# EAGLE schematic VentaConnected_Entwurf (EAGLE 8.2.1)
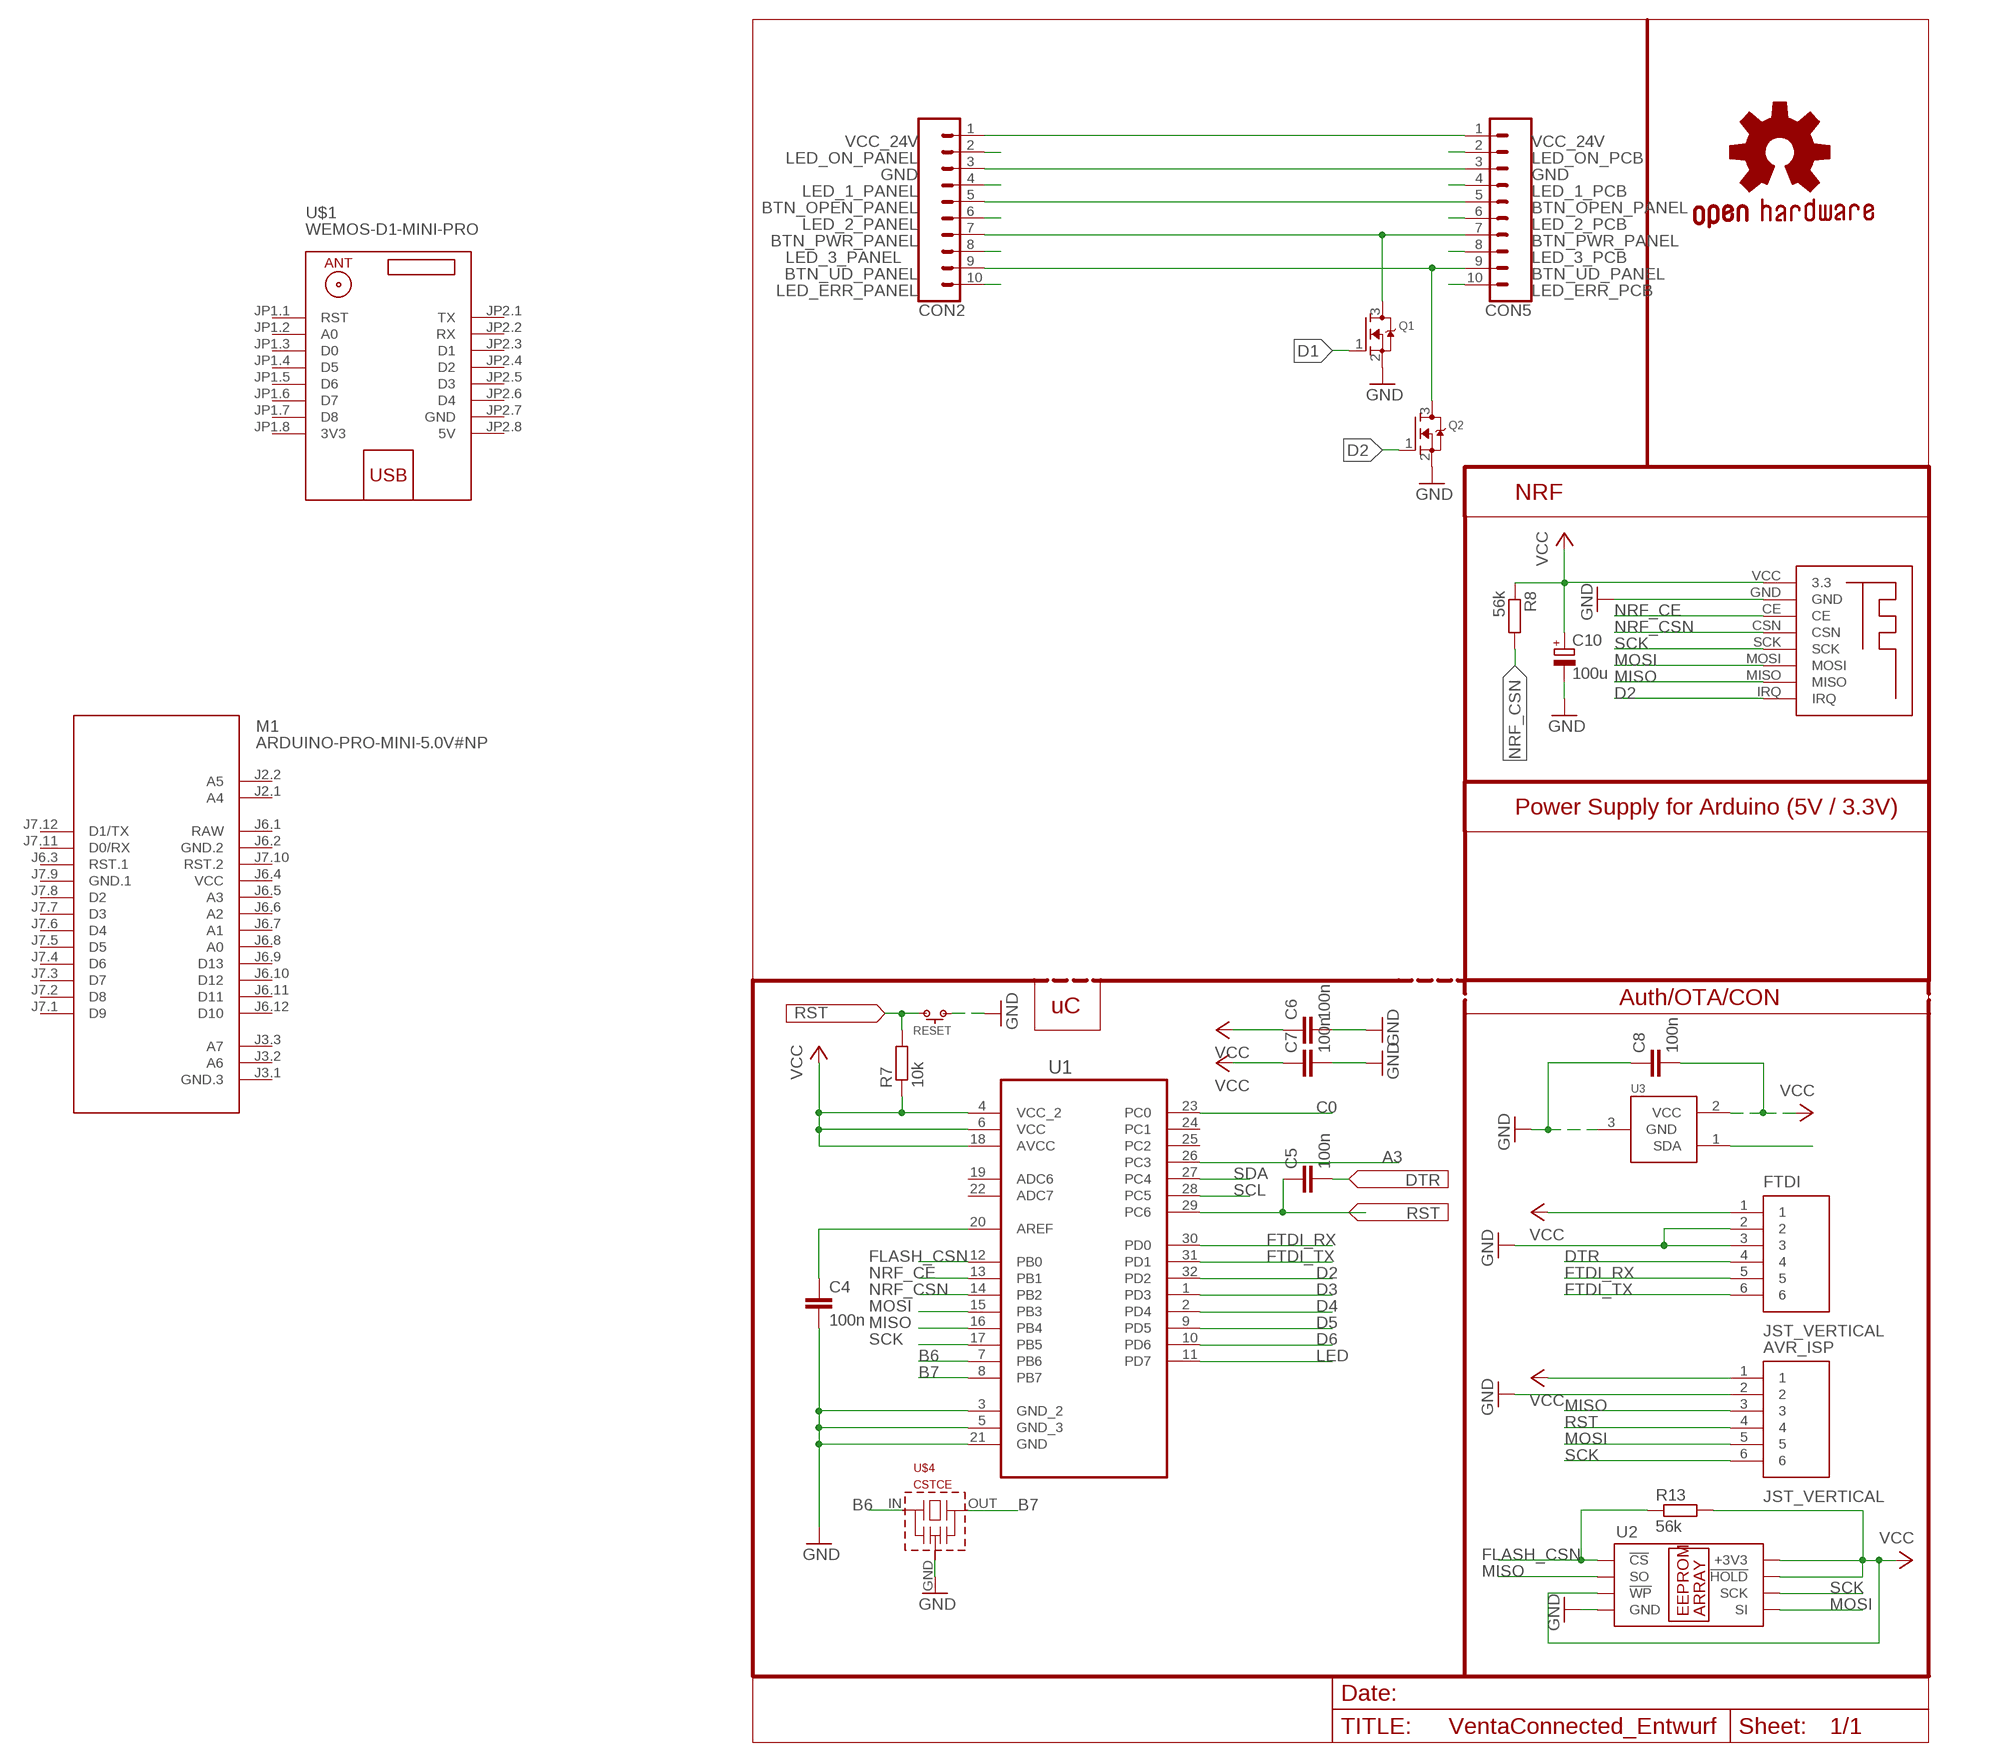
[diagram p0: schematic, sheet 1]

## Parts
AVR_ISP  JST_VERTICAL  [JST-6-SMD-VERT-1.0MM]
C4  100n  C-EUC0805  [C0805]
C5  100n  C-EUC0805  [C0805]
C6  100n  C-EUC0805  [C0805]
C7  100n  C-EUC0805  [C0805]
C8  100n  C-EUC0805  [C0805]
C10  100u  CPOL-EUUD-5X5,8  [UD-5X5,8_NICHICON]
CON2  CONN_10LOCK_LONGPADS  [1X10_LOCK_LONGPADS]
CON5  CONN_10LOCK_LONGPADS  [1X10_LOCK_LONGPADS]
FTDI  JST_VERTICAL  [JST-6-SMD-VERT-1.0MM]
GOLD_ORB_SM1  OSHWLOGO_GOLD_ORB_SM  [OSHW2]
M1  ARDUINO-PRO-MINI-5.0V#NP  [ARDUINO-PRO-MINI#NP]
Q1  MOSFET-NREFLOW  [SOT23]
Q2  MOSFET-NREFLOW  [SOT23]
R7  10k  R-EU_R0805  [R0805]
R8  56k  R-EU_R0805  [R0805]
R13  56k  R-EU_R0805  [R0805]
RESET  SPST.B3U-1000P(M)  [B3U-1000P(M)]
U1  ATMEGA328P-AU  [QFP80P900X900X120-32N]
U2  IC_EEPROM  [SO-08]
U3  IC_ATSHA204A_CRYPT  [SOT23-3]
U$1  WEMOS-D1-MINI-PRO  [WEMOS-D1-MINI-PRO]
U$2  NRF24SMD  [NRF24SMD]
U$4  CSTCE  [CSTCE]

## Nets
A3: U1.26(PC3) U3.1(SDA)
B6: U1.7(PB6) U$4.IN
B7: U1.8(PB7) U$4.OUT
BTN_OPEN_PANEL: CON2.5 CON5.5
BTN_PWR_PANEL: CON2.7 CON5.7 Q1.3(D)
BTN_UD_PANEL: CON2.9 CON5.9 Q2.3(D)
C0: U1.23(PC0)
D1: Q1.1(G)
D2: Q2.1(G) U1.32(PD2) U$2.IRQ
D3: U1.1(PD3)
D4: U1.2(PD4)
D5: U1.9(PD5)
D6: U1.10(PD6)
DTR: C5.2 FTDI.4
FLASH_CSN: R13.1 U1.12(PB0) U2.1(!CS)
FTDI_RX: FTDI.5 U1.30(PD0)
FTDI_TX: FTDI.6 U1.31(PD1)
GND: CON2.3 CON5.3 Q1.2(S) Q2.2(S)
GND_ARD: AVR_ISP.2 C4.2 C6.2 C7.2 C8.1 C10.- FTDI.2 FTDI.3 RESET.1 U1.3(GND_2) U1.5(GND_3) U1.21(GND) U2.4(GND) U3.3(GND) U$2.GND U$4.GND ; supply symbol labelled GND
LED: U1.11(PD7)
LED_1_PANEL: CON2.4
LED_1_PCB: CON5.4
LED_2_PANEL: CON2.6
LED_2_PCB: CON5.6
LED_3_PANEL: CON2.8
LED_3_PCB: CON5.8
LED_ERR_PANEL: CON2.10
LED_ERR_PCB: CON5.10
LED_ON_PANEL: CON2.2
LED_ON_PCB: CON5.2
MISO: AVR_ISP.3 U1.16(PB4) U2.2(SO) U$2.MISO
MOSI: AVR_ISP.5 U1.15(PB3) U2.5(SI) U$2.MOSI
N$25: C4.1 U1.20(AREF)
NRF_CE: U1.13(PB1) U$2.CE
NRF_CSN: R8.2 U1.14(PB2) U$2.CSN
RST: AVR_ISP.4 C5.1 R7.2 RESET.2 U1.29(PC6)
SCK: AVR_ISP.6 U1.17(PB5) U2.6(SCK) U$2.SCK
SCL: U1.28(PC5)
SDA: U1.27(PC4)
VCC_24V: CON2.1 CON5.1
VCC_ARD: AVR_ISP.1 C6.1 C7.1 C8.2 C10.+ FTDI.1 R7.1 R8.1 R13.2 U1.4(VCC_2) U1.6(VCC) U1.18(AVCC) U2.3(!WP) U2.7(!HOLD) U2.8(+3V3) U3.2(VCC) U$2.VCC(3.3) ; supply symbol labelled VCC
Unconnected: M1.J2.1(A4) M1.J2.2(A5) M1.J3.1(GND.3) M1.J3.2(A6) M1.J3.3(A7) M1.J6.3(RST.1) M1.J6.5(A3) M1.J6.6(A2) M1.J6.7(A1) M1.J6.8(A0) M1.J6.9(D13) M1.J6.10(D12) M1.J6.11(D11) M1.J6.12(D10) M1.J7.1(D9) M1.J7.2(D8) M1.J7.3(D7) M1.J7.4(D6) M1.J7.5(D5) M1.J7.6(D4) M1.J7.7(D3) M1.J7.8(D2) M1.J7.10(RST.2) M1.J7.11(D0/RX) M1.J7.12(D1/TX) U1.19(ADC6) U1.22(ADC7) U1.24(PC1) U1.25(PC2) U$1.JP1.1(RST) U$1.JP1.2(A0) U$1.JP1.3(D0) U$1.JP1.4(D5) U$1.JP1.5(D6) U$1.JP1.6(D7) U$1.JP1.7(D8) U$1.JP2.1(TX) U$1.JP2.2(RX) U$1.JP2.3(D1) U$1.JP2.4(D2) U$1.JP2.5(D3) U$1.JP2.6(D4)

## Notes on the sheet
- NRF
- Power Supply for Arduino (5V / 3.3V)
- Auth/OTA/CON
- uC

## Power pins joined to a net without a drawn wire
3V3: U$1.JP1.8(3V3)
5V: U$1.JP2.8(5V)
GND: U$1.JP2.7(GND)
GND.1: M1.J7.9(GND.1)
GND.2: M1.J6.2(GND.2)
RAW: M1.J6.1(RAW)
VCC: M1.J6.4(VCC)

## Library data of the parts
AVR_ISP FTDI = SparkFun-Connectors:JST_VERTICAL; PROD_ID: CONN-08249
C4-C8 = rcl:C-EU: CAPACITOR, European symbol
C10 = rcl:CPOL-EU: POLARIZED CAPACITOR, European symbol
CON2 CON5 = SparkFun-Connectors:CONN_10: Multi connection point. Often used as Generic Header-pin footprint for 0.1 inch spaced/style header connections On any of the 0.1 inch spaced packages, you can populate with these: Break Away Headers - Straight <https://www.sparkfun.com/products/116> (PRT-00116) Break Away Male Headers - Right Angle <https://www.sparkfun.com/products/553> (PRT-00553) Female Headers <https://www.sparkfun.com/products/115> (PRT-00115) Break Away Headers - Machine Pin <https://www.sparkfun.com/products/117> (PRT-00117) Break Away Female Headers - Swiss Machine Pin <https://www.sparkfun.com/products/743> (PRT-00743) Arduino Stackable Header - 10 Pin <https://www.sparkfun.com/products/11376> (PRT-11376) For SCREWTERMINALS and SPRING TERMINALS visit here: Screw Terimnals on SparkFun.com <https://www.sparkfun.com/search/results?term=Screw+Terminals> (5mm/3.5mm/2.54mm spacing) This device is also useful as a general connection point to wire up your design to another part of your project. Our various solder wires solder well into these plated through hole pads. Hook-Up Wire - Assortment (Stranded, 22 AWG) <https://www.sparkfun.com/products/11375> (PRT-11375) Hook-Up Wire - Assortment (Solid Core, 22 AWG) <https://www.sparkfun.com/products/11367> (PRT-11367) View the entire wire category on our website here <https://www.sparkfun.com/categories/141> Special notes: Molex polarized connector foot print use with SKU : PRT-08231 with associated crimp pins and housings. 1MM SMD Version SKU: PRT-10208 NOTES ON THE VARIANTS LOCK and LOCK_LONGPADS... This footprint was designed to help hold the alignment of a through-hole component (i.e. 6-pin header) while soldering it into place. You may notice that each hole has been shifted either up or down by 0.005 of an inch from it's more standard position (which is a perfectly straight line). This slight alteration caused the pins (the squares in the middle) to touch the edges of the holes. Because they are alternating, it causes a "brace" to hold the component in place. 0.005 has proven to be the perfect amount of "off-center" position when using our standard breakaway headers. Although looks a little odd when you look at the bare footprint, once you have a header in there, the alteration is very hard to notice. Also,if you push a header all the way into place, it is covered up entirely on the bottom side.
GOLD_ORB_SM1 = bfl:OSHWLOGO: These are Open-Source Hardware logos.
M1 = diy-modules:ARDUINO-PRO-MINI-*#NP: Arduino Pro Mini (and compatible devices) without programming pads More details available here: https://www.arduino.cc/en/Main/ArduinoBoardProMini Click here to find device on ebay.com <http://www.ebay.com/sch/arduino+pro+mini>
Q1 Q2 = adafruit:MOSFET-N: N-Channel Mosfet 2N7002E - 60V 260mA SOT23 [Digikey: 2N7002ET1GOSTR-ND] - REEL BSH103 - 30V 850mA SOT23 [Digikey: 568-5013-1-ND]
R7 R8 R13 = rcl:R-EU_: RESISTOR, European symbol
RESET = omron:SPST
U1 = Atmel_By_element14_Batch_1-00:ATMEGA328P-AU: 8-bit Microcontroller with In-System Programmable Flash; MPN: ATMEGA328P-AU; OC_FARNELL: 1715486; OC_NEWARK: 14R4631; PACKAGE: TQFP-32; SUPPLIER: Atmel
U2 = TD-MySensors:IC_EEPROM
U3 = TD-MySensors:IC_ATSHA204A_CRYPT
U$1 = diy-modules:WEMOS-D1-MINI-PRO: WEMOS D1 mini Pro: Mini Wi-Fi Board based on ESP-8266EX chip More details can be found here: https://www.wemos.cc/product/d1-mini-pro.html Click here to find device on ebay.com <http://www.ebay.com/sch/wemos+d1+mini+pro>
U$2 = NRF24_SMD:NRF24SMD
U$4 = murata-cstcc-cstce-cstcr-cstcv-resonators:CSTCE: Murata CSTCE Resonator - 3,2 x 1,3 mm